# Altium schematic sheet Usb_To_UART.SchDoc
size A; Organization: Altium Limited; Address1: 29 Dương Khuê; Address2: 2022 VIA Project; Address3: Draw by:; Address4: Tú Đặng
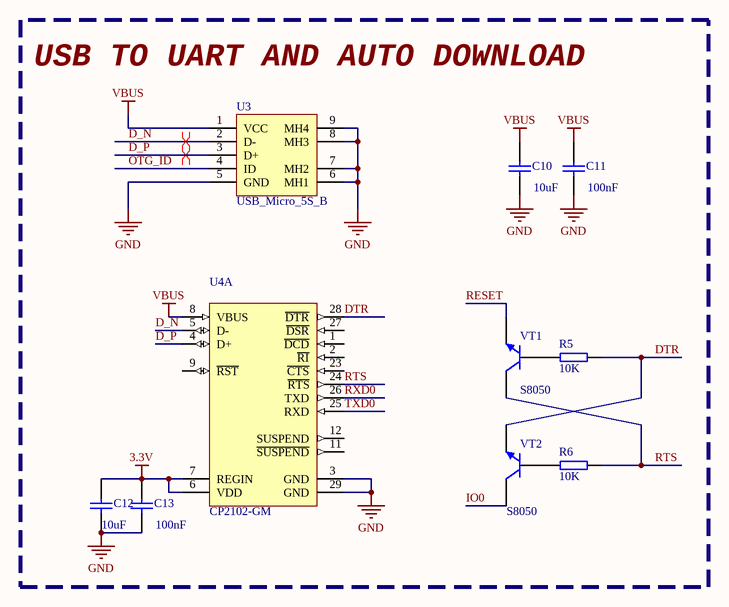
[diagram p0: Usb_To_UART.SchDoc]

## Parts
C10  value 10uF  [SMT0603]  (hidden comment: Cap Semi)
C11  value 100nF  [SMT0603]  (hidden comment: Cap Semi)
C12  value 10uF  [SMT0603]  (hidden comment: Cap Semi)
C13  value 100nF  [SMT0603]  (hidden comment: Cap Semi)
R5  value 10K  [SMT0603]  (hidden comment: Resistor)
R6  value 10K  [SMT0603]  (hidden comment: Resistor)
U3  USB_Micro_5S_B  [USB_MICRO_5S_B]
U4  CP2102-GM  [CP2102]  (part A of 2)
VT1  S8050  [SMT_TRIODE_NPN]
VT2  S8050  [SMT_TRIODE_NPN]

## Blocks framed on the sheet
USB TO UART AND AUTO DOWNLOAD: C10-C13 R5 R6 U3 U4 VT1 VT2

## Nets
3.3V: C12.2 C13.2 U4.6(VDD) U4.7(REGIN)
GND: C10.1 C11.1 C12.1 C13.1 U3.5(GND) U3.6(MH1) U3.7(MH2) U3.8(MH3) U3.9(MH4) U4.3(GND) U4.29(GND)
VBUS: C10.2 C11.2 U3.1(VCC) U4.8(VBUS)
D_N: U3.2(D-) U4.5(D-)
D_P: U3.3(D+) U4.4(D+)
DTR: R5.1 U4.28(~{DTR}) VT2.2(E)
IO0: VT2.3(C)
OTG_ID: U3.4(ID)
RESET: VT1.2(E)
RTS: R6.1 U4.24(~{RTS}) VT1.3(C)
RXD0: U4.26(TXD)
TXD0: U4.25(RXD)
NetR5_2: R5.2 VT1.1(B)
NetR6_2: R6.2 VT2.1(B)

Not connected (* = marked no-connect by the designer): U4 1(~{DCD}) 2(~{RI}) 9(~{RST}) 11(~{SUSPEND}) 12(SUSPEND) 23(~{CTS}) 27(~{DSR})

## Layout directives
differential pair: D_N, D_P

## Notes on the sheet
- Title
- Size:
- Date:
- A
- CN:
- Time:
- Revision:
- Sheet
- of
- Maker Việt
- 29 Dương Khuê
- 2022 VIA Project
- Draw by:
- Tú Đặng
- File:

## Library data of the parts
C10 C12 = CAP-SM-0603-X5R-10uF: CAP SM 0603 X5R 10uF 10%; Tolerance: ±10%; Supplier 1: Farnell; Supplier 2: Digi-Key; Supplier Part Number 1: 2366833; Supplier Part Number 2: 490-3896-1-ND
C11 C13 = CAP-SM-0603-X7R-100nF: CAP SM 0603 X7R 100nF 10%; Tolerance: ±10%; Supplier 1: Digi-Key; Supplier 2: Farnell; Supplier Part Number 1: 490-3167-1-ND; Supplier Part Number 2: 1775994RL
R5 R6 = RES-SM-0603-10K: RES SM 0603 10K; Supplier 1: Farnell; Supplier 2: Digi-Key; Supplier Part Number 1: 9330399; Supplier Part Number 2: 541-10.0KHCT-ND
U3 = USB_Micro_5S_B: USB micro female SMT with 4 fixed foot
U4 = CP2102-GM: Single-Chip USB to UART Bridge, 1024 Bytes EEPROM, -40 to 85 degC, 28-pin QFN, Tube; Manufacturer: Silicon Labs; Internal Oscillator: TRUE; Sub-Family: USB Bridges; DatasheetVersion: Rev. 1.5; PackageReference: QFN-28; PackageDescription: 28-Pin Quad-Flat No-Leads Package, Body 5 x 5 mm, Pitch 0.5 mm; Supplier 1: Digi-Key; Supplier Part Number 1: 336-1160-5-ND; Supplier 2: Farnell; Supplier Part Number 2: 9282130; Supplier 3: Newark; Supplier Part Number 3: 30K5635; Supplier 4: Mouser; Supplier Part Number 4: 634-CP2102-GM; EEPROM: 1024 Bytes; Mounting Technology: Surface Mount; Code_JEDEC: MO-220; Code_IPC: J-STD-020C; PartNumber: CP2102-GM; ComponentLink1Description: Manufacturer URL; ComponentLink1URL: http://www.silabs.com/; ComponentLink2Description: Datasheet; ComponentLink2URL: http://www.silabs.com/Support%20Documents/TechnicalDocs/CP2102-9.pdf; ComponentLink3Description: Package Specification; ComponentLink3URL: http://www.silabs.com/Support%20Documents/TechnicalDocs/C8051T61x.pdf
VT1 VT2 = SMT_TRIODE_NPN: Surface mount NPN transistor, package SOT-23